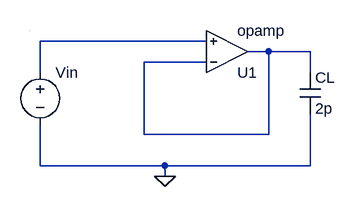
[diagram p0: schematic tran_setup.asc]
tran_setup.asc, the LTspice schematic file:
Version 4
SHEET 1 880 680
WIRE 272 16 16 16
WIRE 368 32 336 32
WIRE 432 32 368 32
WIRE 272 48 176 48
WIRE 16 64 16 16
WIRE 432 64 432 32
WIRE 176 160 176 48
WIRE 368 160 368 32
WIRE 368 160 176 160
WIRE 16 208 16 144
WIRE 208 208 16 208
WIRE 432 208 432 128
WIRE 432 208 208 208
WIRE 208 224 208 208
WIRE 0 0 0 0
FLAG 208 224 0
SYMBOL Opamps\\opamp 304 96 M180
SYMATTR InstName U1
SYMBOL cap 416 64 R0
SYMATTR InstName CL
SYMATTR Value 2p
SYMBOL voltage 16 48 R0
SYMATTR InstName Vin
SYMATTR Value ""

The netlist it stands for:
* tran_setup.asc
XU1 N002 N001 N002 opamp Aol=100K GBW=10Meg  ; pins invin noninvin out
CL N002 0 2p
Vin N001 0
.backanno
.end